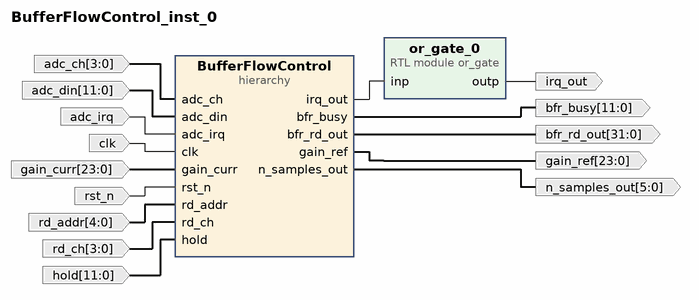
[diagram p0: block diagram of the top level]
# Vivado block design BufferFlowControl_inst_0, xczu3eg-sbva484-1-i, Vivado 2020.2
create_bd_design BufferFlowControl_inst_0

create_bd_port -dir I -from 3 -to 0 adc_ch
create_bd_port -dir I -from 11 -to 0 adc_din
create_bd_port -dir I -type intr adc_irq
create_bd_port -dir I -type clk clk
create_bd_port -dir I -from 23 -to 0 gain_curr
create_bd_port -dir O -from 23 -to 0 gain_ref
create_bd_port -dir I -type rst rst_n
create_bd_port -dir O -from 31 -to 0 bfr_rd_out
create_bd_port -dir O -from 11 -to 0 bfr_busy
create_bd_port -dir O -from 5 -to 0 n_samples_out
create_bd_port -dir O irq_out
create_bd_port -dir I -from 4 -to 0 rd_addr
create_bd_port -dir I -from 3 -to 0 rd_ch
create_bd_port -dir I -from 11 -to 0 hold

create_bd_cell -type hier BufferFlowControl
create_bd_cell -type module -reference or_gate or_gate_0

# ---- hierarchy /BufferFlowControl ----
current_bd_instance /BufferFlowControl
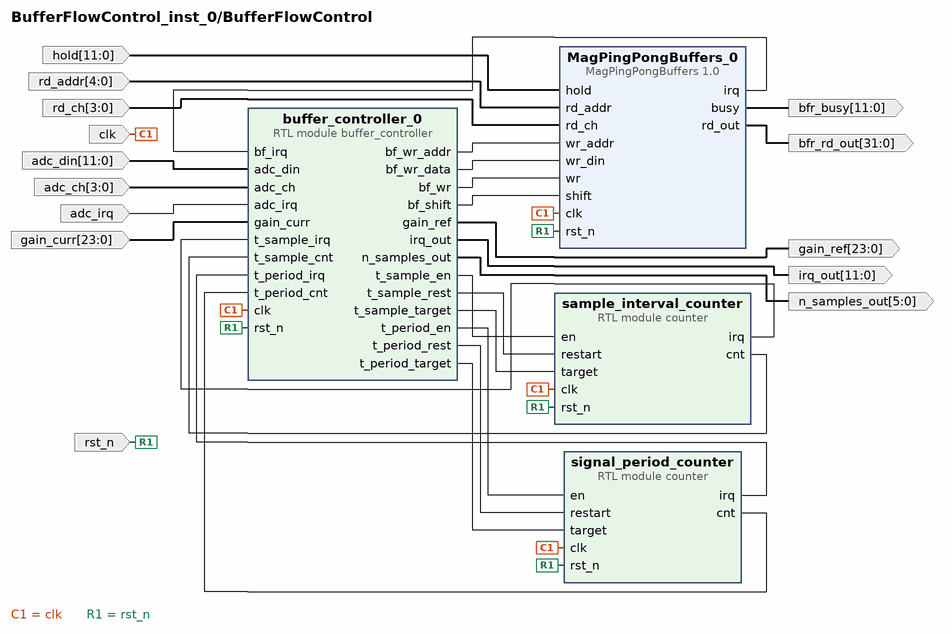
[diagram p1: block diagram inside /BufferFlowControl]
create_bd_pin -dir I -type clk clk
create_bd_pin -dir I -type rst rst_n
create_bd_pin -dir I -from 11 -to 0 adc_din
create_bd_pin -dir I -from 3 -to 0 adc_ch
create_bd_pin -dir I -type intr adc_irq
create_bd_pin -dir I -from 23 -to 0 gain_curr
create_bd_pin -dir O -from 23 -to 0 gain_ref
create_bd_pin -dir O -from 5 -to 0 n_samples_out
create_bd_pin -dir O -from 11 -to 0 irq_out
create_bd_pin -dir O -from 11 -to 0 bfr_busy
create_bd_pin -dir I -from 11 -to 0 hold
create_bd_pin -dir I -from 4 -to 0 rd_addr
create_bd_pin -dir I -from 3 -to 0 rd_ch
create_bd_pin -dir O -from 31 -to 0 bfr_rd_out

create_bd_cell -type module -reference counter signal_period_counter
set_property -dict {CONFIG.auto_rst {"0"} CONFIG.n_bits 21} [get_bd_cells signal_period_counter]
create_bd_cell -type module -reference counter sample_interval_counter
set_property -dict {CONFIG.auto_rst {"0"} CONFIG.n_bits 20} [get_bd_cells sample_interval_counter]
create_bd_cell -type module -reference buffer_controller buffer_controller_0
set_property -dict [list \
  CONFIG.bf_addr_n_bits 5 \
  CONFIG.t_period_target_val 2000000 \
  CONFIG.t_sample_target_val 100000 \
] [get_bd_cells buffer_controller_0]
create_bd_cell -type ip -vlnv DIII:PL-Mag-Sensor:MagPingPongBuffers:1.0 MagPingPongBuffers_0

# ---- connections ----

current_bd_instance /BufferFlowControl
connect_bd_net [get_bd_pins buffer_controller_0/t_sample_en] [get_bd_pins sample_interval_counter/en]
connect_bd_net [get_bd_pins buffer_controller_0/t_sample_rest] [get_bd_pins sample_interval_counter/restart]
connect_bd_net [get_bd_pins sample_interval_counter/irq] [get_bd_pins buffer_controller_0/t_sample_irq]
connect_bd_net [get_bd_pins sample_interval_counter/cnt] [get_bd_pins buffer_controller_0/t_sample_cnt]
connect_bd_net [get_bd_pins buffer_controller_0/t_sample_target] [get_bd_pins sample_interval_counter/target]
connect_bd_net [get_bd_pins buffer_controller_0/t_period_en] [get_bd_pins signal_period_counter/en]
connect_bd_net [get_bd_pins buffer_controller_0/t_period_rest] [get_bd_pins signal_period_counter/restart]
connect_bd_net -net signal_period_timer_irq [get_bd_pins signal_period_counter/irq] [get_bd_pins buffer_controller_0/t_period_irq]
connect_bd_net -net signal_period_timer_cnt [get_bd_pins signal_period_counter/cnt] [get_bd_pins buffer_controller_0/t_period_cnt]
connect_bd_net [get_bd_pins buffer_controller_0/t_period_target] [get_bd_pins signal_period_counter/target]
connect_bd_net [get_bd_pins buffer_controller_0/bf_wr_addr] [get_bd_pins MagPingPongBuffers_0/wr_addr]
connect_bd_net [get_bd_pins buffer_controller_0/bf_wr_data] [get_bd_pins MagPingPongBuffers_0/wr_din]
connect_bd_net [get_bd_pins buffer_controller_0/bf_wr] [get_bd_pins MagPingPongBuffers_0/wr]
connect_bd_net [get_bd_pins buffer_controller_0/bf_shift] [get_bd_pins MagPingPongBuffers_0/shift]
connect_bd_net [get_bd_pins MagPingPongBuffers_0/irq] [get_bd_pins buffer_controller_0/bf_irq]
connect_bd_net -net clk_0_1 [get_bd_pins clk] \
  [get_bd_pins signal_period_counter/clk] [get_bd_pins sample_interval_counter/clk] [get_bd_pins buffer_controller_0/clk] \
  [get_bd_pins MagPingPongBuffers_0/clk]
connect_bd_net -net rst_n_0_1 [get_bd_pins rst_n] \
  [get_bd_pins signal_period_counter/rst_n] [get_bd_pins sample_interval_counter/rst_n] \
  [get_bd_pins buffer_controller_0/rst_n] [get_bd_pins MagPingPongBuffers_0/rst_n]
connect_bd_net [get_bd_pins adc_din] [get_bd_pins buffer_controller_0/adc_din]
connect_bd_net [get_bd_pins adc_ch] [get_bd_pins buffer_controller_0/adc_ch]
connect_bd_net [get_bd_pins adc_irq] [get_bd_pins buffer_controller_0/adc_irq]
connect_bd_net [get_bd_pins gain_curr] [get_bd_pins buffer_controller_0/gain_curr]
connect_bd_net [get_bd_pins buffer_controller_0/gain_ref] [get_bd_pins gain_ref]
connect_bd_net [get_bd_pins buffer_controller_0/n_samples_out] [get_bd_pins n_samples_out]
connect_bd_net [get_bd_pins buffer_controller_0/irq_out] [get_bd_pins irq_out]
connect_bd_net [get_bd_pins MagPingPongBuffers_0/busy] [get_bd_pins bfr_busy]
connect_bd_net [get_bd_pins hold] [get_bd_pins MagPingPongBuffers_0/hold]
connect_bd_net [get_bd_pins rd_addr] [get_bd_pins MagPingPongBuffers_0/rd_addr]
connect_bd_net [get_bd_pins rd_ch] [get_bd_pins MagPingPongBuffers_0/rd_ch]
connect_bd_net [get_bd_pins MagPingPongBuffers_0/rd_out] [get_bd_pins bfr_rd_out]

current_bd_instance /
connect_bd_net [get_bd_pins BufferFlowControl/gain_ref] [get_bd_ports gain_ref]
connect_bd_net [get_bd_ports adc_ch] [get_bd_pins BufferFlowControl/adc_ch]
connect_bd_net [get_bd_ports adc_din] [get_bd_pins BufferFlowControl/adc_din]
connect_bd_net [get_bd_ports adc_irq] [get_bd_pins BufferFlowControl/adc_irq]
connect_bd_net -net clk_0_1 [get_bd_ports clk] [get_bd_pins BufferFlowControl/clk]
connect_bd_net [get_bd_ports gain_curr] [get_bd_pins BufferFlowControl/gain_curr]
connect_bd_net -net rst_n_0_1 [get_bd_ports rst_n] [get_bd_pins BufferFlowControl/rst_n]
connect_bd_net [get_bd_pins BufferFlowControl/bfr_rd_out] [get_bd_ports bfr_rd_out]
connect_bd_net [get_bd_pins BufferFlowControl/bfr_busy] [get_bd_ports bfr_busy]
connect_bd_net [get_bd_pins BufferFlowControl/n_samples_out] [get_bd_ports n_samples_out]
connect_bd_net [get_bd_pins or_gate_0/outp] [get_bd_ports irq_out]
connect_bd_net [get_bd_pins BufferFlowControl/irq_out] [get_bd_pins or_gate_0/inp]
connect_bd_net -net rd_addr_0_1 [get_bd_ports rd_addr] [get_bd_pins BufferFlowControl/rd_addr]
connect_bd_net -net rd_ch_0_1 [get_bd_ports rd_ch] [get_bd_pins BufferFlowControl/rd_ch]
connect_bd_net -net hold_0_1 [get_bd_ports hold] [get_bd_pins BufferFlowControl/hold]

validate_bd_design
save_bd_design
